# Altium schematic sheet OMODRI_EtherCAT_1.SchDoc
size A4
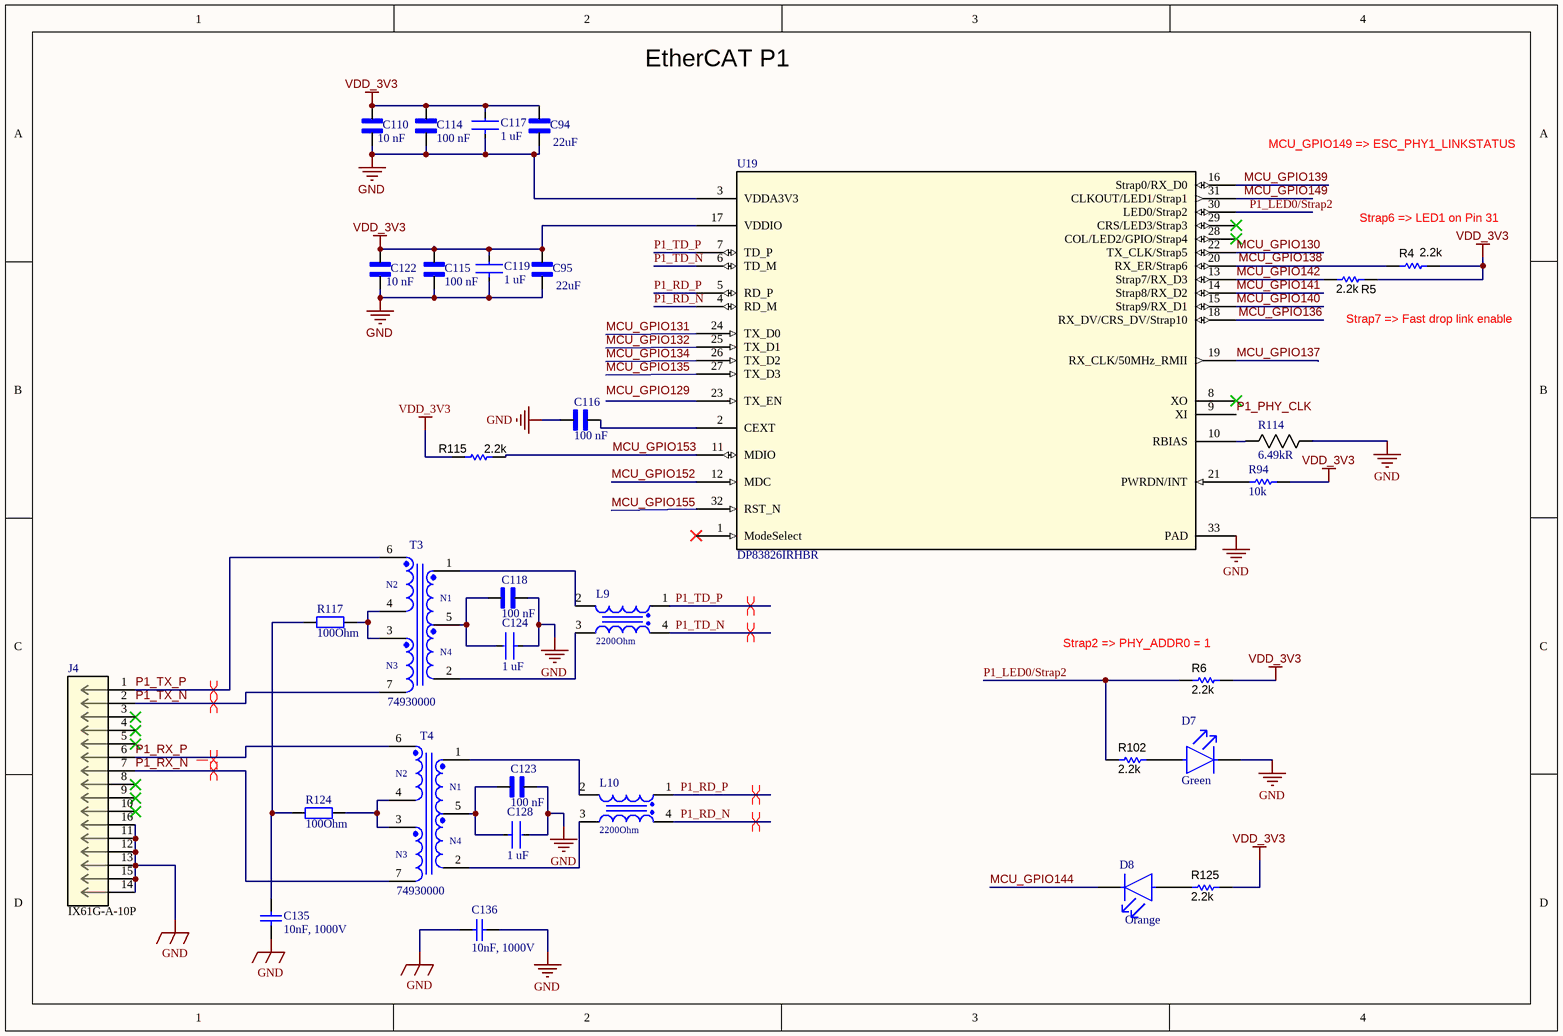
[diagram p0: OMODRI_EtherCAT_1.SchDoc]

## Parts
C94  value 22uF  [CAPC1005X55N]  (hidden comment: CL05A226MQ5N6J8)
C95  value 22uF  [CAPC1005X55N]  (hidden comment: CL05A226MQ5N6J8)
C110  value 10 nF  [CAPC0603X33N]  (hidden comment: GRM033R71E103KE14D)
C114  value 100 nF  [CAPC0603X33N]  (hidden comment: GRM033R61E104KE14D)
C115  value 100 nF  [CAPC0603X33N]  (hidden comment: GRM033R61E104KE14D)
C116  value 100 nF  [CAPC0603X33N]  (hidden comment: GRM033R61E104KE14D)
C117  value 1 uF  [FP-CC0201-BA-MFG]  (hidden comment: CC0201MRX5R5BB105)
C118  value 100 nF  [CAPC0603X33N]  (hidden comment: GRM033R61E104KE14D)
C119  value 1 uF  [FP-CC0201-BA-MFG]  (hidden comment: CC0201MRX5R5BB105)
C122  value 10 nF  [CAPC0603X33N]  (hidden comment: GRM033R71E103KE14D)
C123  value 100 nF  [CAPC0603X33N]  (hidden comment: GRM033R61E104KE14D)
C124  value 1 uF  [FP-CC0201-BA-MFG]  (hidden comment: CC0201MRX5R5BB105)
C128  value 1 uF  [FP-CC0201-BA-MFG]  (hidden comment: CC0201MRX5R5BB105)
C135  10nF, 1000V  [WCAP-CSMH_1206_H=1.25mm]
C136  10nF, 1000V  [WCAP-CSMH_1206_H=1.25mm]
D7  Illumination Color: Green  [ROHM-SML-P11MT_V]  (hidden comment: SML-P11MTT86R)
D8  Color: Orange  [ROHM-SML-P11MT_V]  (hidden comment: SML-P11DTT86R)
J4  Part Number: IX61G-A-10P  [CONN_1G-A-10P]  (value not drawn)
L9  2200Ohm  [WE-CNSW_1206]
L10  2200Ohm  [WE-CNSW_1206]
R4  ValueDisplayed: 2.2k  [0402]  (hidden comment: CRCW04022K20JNED)
R5  ValueDisplayed: 2.2k  [0402]  (hidden comment: CRCW04022K20JNED)
R6  ValueDisplayed: 2.2k  [0402]  (hidden comment: CRCW04022K20JNED)
R94  Resistance: 10k  [RESC1005X40X25LL05T05]  (hidden comment: ERJ2RKF1002X)
R102  ValueDisplayed: 2.2k  [0402]  (hidden comment: CRCW04022K20JNED)
R114  Resistance: 6.49kR  [RES_CRCW_0402]  (hidden comment: Part Number: CRCW04026K49FKED)
R115  ValueDisplayed: 2.2k  [0402]  (hidden comment: CRCW04022K20JNED)
R117  100Ohm  [WRIS-KWKB_0612_H=0.55mm]
R124  100Ohm  [WRIS-KWKB_0612_H=0.55mm]
R125  ValueDisplayed: 2.2k  [0402]  (hidden comment: CRCW04022K20JNED)
T3  74930000  [74930000]
T4  74930000  [74930000]
U19  DP83826IRHBR  [RHB0032B]

## Nets
GND: C94.1 C95.1 C110.1 C114.2 C115.2 C116.2 C117.1 C118.1 C119.1 C122.1 C123.1 C124.1 C128.2 C135.1 C136.1 C136.2 D7.1(C) J4.11 J4.12 J4.13 J4.14 J4.15 J4.16 R114.1 U19.3(VDDA3V3) U19.33(PAD)
VDD_3V3: C94.2 C95.2 C110.2 C114.1 C115.1 C117.2 C119.2 C122.2 R4.1 R5.1 R6.1 R94.1 R115.2 R125.1 U19.17(VDDIO)
MCU_GPIO130: U19.22(TX_CLK/Strap5)
MCU_GPIO131: U19.24(TX_D0)
MCU_GPIO132: U19.25(TX_D1)
MCU_GPIO134: U19.26(TX_D2)
MCU_GPIO135: U19.27(TX_D3)
MCU_GPIO136: U19.18(RX_DV/CRS_DV/Strap10)
MCU_GPIO137: U19.19(RX_CLK/50MHz_RMII)
MCU_GPIO138: R4.2 U19.20(RX_ER/Strap6)
MCU_GPIO139: U19.16(Strap0/RX_D0)
MCU_GPIO140: U19.15(Strap9/RX_D1)
MCU_GPIO141: U19.14(Strap8/RX_D2)
MCU_GPIO142: R5.2 U19.13(Strap7/RX_D3)
MCU_GPIO144: D8.1(C)
MCU_GPIO149: U19.31(CLKOUT/LED1/Strap1)
MCU_GPIO152: U19.12(MDC)
MCU_GPIO153: R115.1 U19.11(MDIO)
MCU_GPIO155: U19.32(RST_N)
P1_LED0/Strap2: R6.2 R102.1 U19.30(LED0/Strap2)
P1_PHY_CLK: U19.9(XI)
P1_RD_N: L10.4 U19.4(RD_M)
P1_RD_P: L10.1 U19.5(RD_P)
P1_RX_N: J4.7 T4.7
P1_RX_P: J4.6 T4.6
P1_TD_N: L9.4 U19.6(TD_M)
P1_TD_P: L9.1 U19.7(TD_P)
P1_TX_N: J4.2 T3.7
P1_TX_P: J4.1 T3.6
NetC116_1: C116.1 U19.2(CEXT)
NetC118_2: C118.2 C124.2 T3.5
NetC123_2: C123.2 C128.1 T4.5
NetC135_2: C135.2 R117.1 R124.1
NetD7_2: D7.2(A) R102.2
NetD8_2: D8.2(A) R125.2
NetL9_2: L9.2 T3.1
NetL9_3: L9.3 T3.2
NetL10_2: L10.2 T4.1
NetL10_3: L10.3 T4.2
NetR94_2: R94.2 U19.21(PWRDN/INT)
NetR114_2: R114.2 U19.10(RBIAS)
NetR117_2: R117.2 T3.3 T3.4
NetR124_2: R124.2 T4.3 T4.4

Not connected (* = marked no-connect by the designer): J4 3* 4* 5* 8* 9* 10*; U19 1(ModeSelect)* 8(XO)* 23(TX_EN) 28(COL/LED2/GPIO/Strap4)* 29(CRS/LED3/Strap3)*

## Layout directives
differential pair: (no net found under the mark), P1_RD_N, P1_RD_P, P1_RX_N, P1_TD_N, P1_TD_P, P1_TX_N, P1_TX_P

## Notes on the sheet
- EtherCAT P1
- MCU_GPIO149 => ESC_PHY1_LINKSTATUS
- Strap6 => LED1 on Pin 31
- Strap7 => Fast drop link enable
- (near R6) Strap2 => PHY_ADDR0 = 1
- Labels drawn without touching a wire or pin: MCU_GPIO129
- (in symbol 74930000) N2; N1; N4; N3

## Library data of the parts
C94 C95 = CL05A226MQ5N6J8: 22µF ±20% 6.3V Ceramic Capacitor X5R 0402 (1005 Metric); MF: Samsung Electro-Mechanics; Package: 0402 Samsung Electro-Mechanics; Availability: Unavailable; MP: CL05A226MQ5N6J8; DigiKey-Purchase-URL: https://snapeda.com/shop?store=DigiKey&id=3601912; SnapEDA_Link: https://www.snapeda.com/parts/CL05A226MQ5N6J8/Samsung%20Electro-Mechanics/view-part/3601912/?ref=snap; Price: None
C110 C122 = GRM033R71E103KE14D: SMD Capacitor X7R_EIA_ with Capacitance: 10000pF Tol. 10%. Rated Voltage: 25Vdc; MF: Murata; SnapEDA_Link: https://www.snapeda.com/parts/GRM033R71E103KE14D/Murata/view-part/4379447/?ref=snap; Package: 0603 Taiyo Yuden; MP: GRM033R71E103KE14D; Digi-Key_Purchase_URL: https://www.digikey.com/product-detail/en/murata-electronics/GRM033R71E103KE14D/490-14454-1-ND/6606915?utm_source=snapeda&utm_medium=aggregator&utm_campaign=symbol; Digi-Key_Part_Number: 490-14454-1-ND
C114-C116 C118 C123 = GRM033R61E104KE14D: SMD Capacitor X5R_EIA_ with Capacitance: 0.10uF Tol. 10%. Rated Voltage: 25Vdc; MF: Murata; SnapEDA_Link: https://www.snapeda.com/parts/GRM033R61E104KE14D/Murata/view-part/4375622/?ref=snap; Availability: Unavailable; MP: GRM033R61E104KE14D; Package: 0603 Taiyo Yuden; Price: None
C117 C119 C124 C128 = CMP-03422-000660-1: CAP CER 1UF 6.3V X5R 0201; Manufacturer: Yageo; Material: Ceramic; Tolerance: 0.2; Temperature Coefficient: 15%; Lead Free: Yes; Capacitance: 1 uF; ComponentLink2URL: http://www.yageo.com/documents/recent/UPY-GPHC_X5R_4V-to-50V_25.pdf; Footprint Url: http://www.yageo.com/exep/pages/download/literatures/UPY-C_GEN_24.pdf; Temperature Range Low: -55°C; Category: Cap; Device Class L3: Ceramic Capacitors; Device Class L2: Capacitors; Digikey Description: CAP CER 1UF 6.3V X5R 0201; Automotive: No; Temperature: -55°C to +85°C; RoHS: TRUE; Octopart: https://octopart.com/cc0201mrx5r5bb105-yageo-33242268; Height: 0.33mm; Temperature Range High: +85°C; Temperature Characteristic: X5R; Device Class L1: Passive Components; Package: CC0201-BA; ComponentLink2Description: Datasheet; Manufacturer Part Number: CC0201MRX5R5BB105; Voltage Rating: 6.3 V; Mouser Description: Multilayer Ceramic Capacitors MLCC - SMD/SMT 1.0uF 6.3V X5R 20%; Ipc Land Pattern Name: CAPC6030X30
C135 C136 = 885342208021: WCAP-CSMH Ceramic Capacitors, size 1206, 10nF, 1000VDC; Ceramic Type: X7R Class II; Dissipation Factor: 2.5%; Insulation Resistance: 10GOhm; Technical Reference: X7R1206103KA00DFCT10000; ComponentLink1Description: Manufacturer; ComponentLink1URL: http://www.we-online.de; ComponentLink2Description: Datasheet; ComponentLink2URL: https://katalog.we-online.com/pbs/datasheet/885342208021.pdf; Packaging: Tape and Reel; Part Number: 885342208021; Published Date: August 2019; Rated Voltage: 1000VDC; Size: 1206; Mounting Technology: SMD; Publisher: Wurth Elektronik; Capacitance: 10nF; Operating Temperature: -55 to +125degC
D7 = SML-P11MTT86R: LED Uni-Color Yellow Green 2-Pin Chip 0402(1006Metric) T/R; Manufacturer: Rohm; Lens Color: Colorless,Clear; Lens Style: Diffused,Colorless,Rectangular,Square,Clear; Number of LEDs: 1; Luminous Intensity: 2.1mcd; Forward Voltage: 1.9V; Wavelength: 569nm; Forward Current: 20mA; Test Current: 1mA; Lens Transparency: Clear; Viewing Angle: 150°; Power Rating: 54mW; Color: Green,Yellow; Supplier 1: Digi-Key; Manufacturer Part Number: SML-P11MTT86; RoHS: Yes; Category: LEDs; Stock 1: 6550; Pricing 1: 1=0,39000, 10=0,27200, 100=0,15890, 500=0,10896, 1000=0,09080, 2500=0,08172, 5000=0,07718 (USD); Mount: Surface Mount; Case/Package: 0402; Number of Pins: 2; Case Code (Imperial): 0402; Case Code (Metric): 1005; Min Operating Temperature: -40°C; Max Operating Temperature: 85°C; Packaging: Tape and Reel; Dominant Wavelength: 569nm; Package Quantity: 1; Length: 1mm; Height: 0.25mm; Width: 0.6mm; Radiation Hardening: No; REACH SVHC: No SVHC; Lead Free: Lead Free; ComponentLink1URL: https://datasheet.ciiva.com/5685/1738942-5685465.pdf?src-supplier=Farnell; ComponentLink1Description: https://datasheet.ciiva.com/5685/1738942-5685465.pdf?src-supplier=Farnell; ComponentLink2URL: https://datasheet.ciiva.com/11773/0900766b80df3ad7-11773737.pdf?src-supplier=RSComponents; ComponentLink2Description: https://datasheet.ciiva.com/11773/0900766b80df3ad7-11773737.pdf?src-supplier=RSComponents; ComponentLink3URL: https://datasheet.ciiva.com/16201/sml-p11mtt86-16201197.pdf?src-supplier=Future+Electronics; ComponentLink3Description: https://datasheet.ciiva.com/16201/sml-p11mtt86-16201197.pdf?src-supplier=Future+Electronics; ComponentLink4URL: https://datasheet.ciiva.com/2114/sml-p11-p-eco-2114983.pdf?src-supplier=Digi-Key; ComponentLink4Description: https://datasheet.ciiva.com/2114/sml-p11-p-eco-2114983.pdf?src-supplier=Digi-Key; ComponentLink5URL: https://datasheet.ciiva.com/2114/sml-p11-p-eco-2114984.pdf?src-supplier=Digi-Key; ComponentLink5Description: https://datasheet.ciiva.com/2114/sml-p11-p-eco-2114984.pdf?src-supplier=Digi-Key; ComponentLink6URL: https://datasheet.ciiva.com/2114/sml-p11-p-eco-2114985.pdf?src-supplier=Digi-Key; ComponentLink6Description: https://datasheet.ciiva.com/2114/sml-p11-p-eco-2114985.pdf?src-supplier=Digi-Key; ComponentLink7URL: https://datasheet.ciiva.com/4689/sml-p1-471200-4689502.pdf?src-supplier=Mouser; ComponentLink7Description: https://datasheet.ciiva.com/4689/sml-p1-471200-4689502.pdf?src-supplier=Mouser; ComponentLink8URL: https://datasheet.ciiva.com/29281/157928-da-01-en-led-0402-gelb-gruen-sml-p11mt-t86-29281338.pdf?src-supplier=Conrad; ComponentLink8Description: https://datasheet.ciiva.com/29281/157928-da-01-en-led-0402-gelb-gruen-sml-p11mt-t86-29281338.pdf?src-supplier=Conrad; Supplier Part Number 1: 511-1652-1-ND
D8 = SML-P11DTT86R: LED ORANGE CLEAR 1006 SMD; Manufacturer: Rohm; Lens Color: Colorless; Luminous Intensity: 7.3mcd; Test Current: 1mA; Dominant Wavelength: 605nm; Forward Voltage: 1.9V; Lens Style: Square,Diffused,Colorless; Number of LEDs: 1; Supplier 1: Digi-Key; Manufacturer Part Number: SML-P11DTT86R; RoHS: Yes; Category: LEDs; Stock 1: 2306; Pricing 1: 1=0,48000, 10=0,34300, 100=0,22400, 500=0,16100, 1000=0,12600, 2500=0,11550 (USD); Mount: Surface Mount; Case/Package: SMD/SMT; Number of Pins: 2; Lens Transparency: Clear; Forward Current: 1mA; Wavelength: 605nm; Packaging: Tape and Reel; Length: 1mm; Height: 0.25mm; Width: 0.6mm; REACH SVHC: Unknown; Lead Free: Lead Free; ComponentLink1URL: https://datasheet.ciiva.com/48679/sml-p11-p-eco-48679066.pdf?src-supplier=Avnet; ComponentLink1Description: https://datasheet.ciiva.com/48679/sml-p11-p-eco-48679066.pdf?src-supplier=Avnet; Supplier Part Number 1: SML-P11DTT86RCT-ND
J4 = IX61G-A-10P: Conn Ethernet Connector RCP 10 POS Solder RA Thru-Hole 10 Terminal 1 Port Cat 5e/Cat 6a Reel; Vendor: Hirose; Built_By: EMA_Matt; SourceLibrary: Hirose_12_20_2019; Connector Type: Receptacle; Number of Positions: 10; Manufacturer_Part_Number: IX61G-A-10P; Copyright: Copyright (C) 2018 Accelerated Designs. All rights reserved; RefDes: RefDes; Type: DEV; Value: Value; Supplier 1: Digi-Key; Manufacturer: Hirose; Manufacturer Part Number: IX61G-A-10P; RoHS: No; Category: Connectors; Stock 1: 3441; Pricing 1: 1=3,52000, 10=3,37900, 25=3,09760, 50=2,95680, 100=2,81600 (USD); Mount: Surface Mount; Contact Plating: Gold; Packaging: Tape and Reel; Termination: Solder; ComponentLink1URL: http://www.farnell.com/datasheets/2691134.pdf?src-supplier=Farnell; ComponentLink1Description: http://www.farnell.com/datasheets/2691134.pdf?src-supplier=Farnell; ComponentLink2URL: https://www.hirose.com/product/download/?distributor=digikey&amp;type=2d&amp;lang=en&amp;num=IX61G-A-10P&src-supplier=Digi-Key; ComponentLink2Description: https://www.hirose.com/product/download/?distributor=digikey&amp;type=2d&amp;lang=en&amp;num=IX61G-A-10P&src-supplier=Digi-Key; Supplier Part Number 1: H125667CT-ND
L9 L10 = 744232222: WE-CNSW SMT Common Mode Line Filter, size 1206, 2200Ohm, 0.2A, 50V; Manufacturer: Wurth Elektronik; DC Resistance max.: 1.2Ohm; Impedance Test Condition: 100MHz; Insulation Test Voltage: 125VAC; Winding Style: bifiliar; ComponentLink1Description: Manufacturer; ComponentLink1URL: http://www.we-online.de; ComponentLink2Description: Datasheet; ComponentLink2URL: https://www.we-online.com/catalog/datasheet/744232222.pdf; Operating Temperature: -40 to +125degC; Packaging: Tape and Reel; Published Date: April 2020; Rated Current: 0.2A; Size: 1206; Impedance: 2200Ohm; Manufacturer Part Number: 744232222; Rated Voltage: 50V; Mounting Technology: SMT
R4-R6 R102 R115 R125 = CMP-0026890-5: RES, 2.2 k, 5%, 0.063 W, AEC-Q200 Grade 0, 0402; Manufacturer: Vishay-Dale; Power_W: 63mW; TempCo: 200 ppm/C; Value_Code: 2k20; Value: 2.2k; EIA_Code: E24; SizeX_mm: 1; SizeY_mm: 0.5; SizeZ_mm: 0.6; Value2: 0.063W; AEC Qualified: Y; VDC_V: 50V; AEC Category: Q200; AEC Grade: 0; Supplier Part Number 2: 59M6710; Supplier 2: Newark; Supplier Part Number 3: 71-CRCW0402J-2.2K-E3; Supplier 3: Mouser; RoHS: E; Value1: 5%; MountType: SMT; Supplier 1: Digi-Key; PackageReference: 0402; Tolerance_%: 5%; Res_ohm: 2.2k; SizeArea_mm2: 0.5; CompType: Resistor; PartNumber: CRCW04022K20JNED; ComponentLink1Description: Datasheet link; Supplier Part Number 1: 541-2.2KJCT-ND; Technology: Thick Film; ComponentLink1URL: http://www.vishay.com/docs/20035/dcrcwe3.pdf
R94 = CMP-2000-07588-1: Chip Resistor, 10 KOhm, +/- 1%, 0.1 W, -55 to 155 degC, 0402 (1005 Metric), RoHS, Tape and Reel; Manufacturer: Panasonic; Power Rating: 100mW; Voltage Rating: 50V; Case\/Package: 0402; Temperature Coefficient: 100ppm\/degreesC; RoHSCompliant: True; Lead Free: LeadFree; Package Quantity: 1; Contact Plating: Tin; Length: 1mm; Radiation Hardening: No; REACH SVHC: NoSVHC; Max Operating Temperature: 155degC; Depth: 0.5mm; Case Code (Imperial): 0402; Military Standard: Not; Package Description: 2-Pin Surface Mount Device, Body 1 x 0.5 mm; Termination: SMD/SMT; Case Code (Metric): 1005; Height: 0.35mm; Packaging: TapeandReel; Voltage Rating (DC): 50V; Package Reference: 402; Number of Pins: 2; Tolerance: 1%; Mounting Technology: SurfaceMount; Width: 0.02inch; Mount: SurfaceMount; Datasheet URL: https://industrial.panasonic.com/cdbs/www-data/pdf/RDA0000/AOA0000C304.pdf; Composition: ThickFilm; Datasheet Version: 02/2017; Manufacturer URL: http://www.panasonic.com/; Max Power Dissipation: 100mW; Number of Terminations: 2; Min Operating Temperature: -55degC
R114 = CRCW04026K49FKED: Res Thick Film 0402 6.49K Ohm 1% 0.063W(1/16W) ±100ppm/C Pad SMD Automotive T/R; Vendor: Vishay; Built_By: EMA_UL_Team; Temperature Coefficient: 100ppm/°C; Power Rating: 63mW; Voltage Rating: 50V; Manufacturer_Part_Number: CRCW04026K49FKED; Copyright: Copyright (C) 2018 Accelerated Designs. All rights reserved; RefDes: RefDes; Type: DEV; Value: Value; Supplier 1: Digi-Key; Manufacturer: Vishay; Manufacturer Part Number: CRCW04026K49FKED; RoHS: Yes; Category: Chip SMD Resistors; Stock 1: 24052; Pricing 1: 1=0,10000, 10=0,03600, 100=0,01460, 1000=0,00657, 2500=0,00570, 5000=0,00471 (USD); Mount: Surface Mount; Case/Package: 0402; Number of Pins: 2; Weight: 2.3E-05oz; Contact Plating: Tin; Case Code (Metric): 1005; Case Code (Imperial): 0402; Min Operating Temperature: -55°C; Max Operating Temperature: 155°C; Composition: Thick Film; Packaging: Tape and Reel; Package Quantity: 10; Number of Terminations: 2; Max Power Dissipation: 63mW; Voltage Rating (DC): 50V; Military Standard: Not; Termination: SMD/SMT; Features: Automotive AEC-Q200; Length: 1mm; Height: 0.35mm; Width: 0.02inch; Depth: 0.5mm; Radiation Hardening: No; Lead Free: Lead Free; REACH SVHC: Unknown; ComponentLink1URL: https://datasheet.ciiva.com/11818/0900766b80d98824-11818134.pdf?src-supplier=RSComponents; ComponentLink1Description: https://datasheet.ciiva.com/11818/0900766b80d98824-11818134.pdf?src-supplier=RSComponents; ComponentLink2URL: https://datasheet.ciiva.com/2463/dcrcwe3-2463233.pdf?src-supplier=Digi-Key; ComponentLink2Description: https://datasheet.ciiva.com/2463/dcrcwe3-2463233.pdf?src-supplier=Digi-Key; ComponentLink3URL: https://datasheet.ciiva.com/2463/dcrcwe3-2463234.pdf?src-supplier=Digi-Key; ComponentLink3Description: https://datasheet.ciiva.com/2463/dcrcwe3-2463234.pdf?src-supplier=Digi-Key; ComponentLink4URL: https://datasheet.ciiva.com/5551/dcrcwe3-109170-5551783.pdf?src-supplier=Mouser; ComponentLink4Description: https://datasheet.ciiva.com/5551/dcrcwe3-109170-5551783.pdf?src-supplier=Mouser; ComponentLink5URL: https://datasheet.ciiva.com/7679/1697337-7679082.pdf?src-supplier=Element14; ComponentLink5Description: https://datasheet.ciiva.com/7679/1697337-7679082.pdf?src-supplier=Element14; ComponentLink6URL: https://datasheet.ciiva.com/7679/1697337-7679258.pdf?src-supplier=Element14; ComponentLink6Description: https://datasheet.ciiva.com/7679/1697337-7679258.pdf?src-supplier=Element14; ComponentLink7URL: https://datasheet.ciiva.com/2463/dcrcwe3-2463232.pdf?src-supplier=Digi-Key; ComponentLink7Description: https://datasheet.ciiva.com/2463/dcrcwe3-2463232.pdf?src-supplier=Digi-Key; Supplier Part Number 1: 541-6.49KLCT-ND; Tolerance: 1%
R117 R124 = 561020132009: WRIS-KWKB Thick Film Resistors, size 0612, 100Ohm, +/-5%, 0.75W; Rated Current: 86.6mA; Temperature Coefficient of Resistance: +/-200ppm/degC; Technical Reference: KB06121000J304DAATP0000; ComponentLink1Description: Manufacturer; ComponentLink1URL: http://www.we-online.de; ComponentLink2Description: Datasheet; ComponentLink2URL: https://katalog.we-online.com/pbs/datasheet/561020132009.pdf; Publisher: Wurth Elektronik; Rated Power: 0.75W; Resistance: 100Ohm; Mounting Technology: SMT; Height: 0.55mm; Part Number: 561020132009; Packaging: Tape and Reel; Published Date: September 2019; Size: 0612; Length: 1.6mm; Operating Temperature: -55 to +155degC; Resistance Tolerance: +/-5%; Width: 3.2mm
T3 T4 = 74930000: WE-STST Super Tiny Signal Transformer, size 4532, 350uH; Insulation Test Voltage: 1500VRMS; Turns Ratio: 1:1; ComponentLink1Description: Manufacturer; ComponentLink1URL: http://www.we-online.de; ComponentLink2Description: Datasheet; ComponentLink2URL: https://katalog.we-online.com/pbs/datasheet/74930000.pdf; Packaging: Tape and Reel; Publisher: Wurth Elektronik; Size: 4532; Inductance: 350uH; Mounting Technology: SMT; Operating Temperature: -40 to +105degC; Part Number: 74930000; Published Date: November 2019
U19 = DP83826IRHBR: Low latency 10/100-Mbps PHY, MII interface and enhanced mode with an industrial temperature range 32-VQFN -40 to 85; Manufacturer: Texas Instruments; Supplier 1: Avnet; Manufacturer Part Number: DP83826IRHBR; Pricing 1: 3000=1,00750, 6000=0,96850, 12000=0,92300, 18000=0,89700, 24000=0,86450 (USD); ComponentLink1URL: https://octopart.com/click/track?ai=8629&ct=datasheets&sig=00cfb32&at=physicalpart&sid=370&ppid=108112645&hlid=29178382&src-supplier=TI+store; ComponentLink1Description: https://octopart.com/click/track?ai=8629&ct=datasheets&sig=00cfb32&at=physicalpart&sid=370&ppid=108112645&hlid=29178382&src-supplier=TI+store; Supplier Part Number 1: DP83826IRHBR